# Altium project ToF Sensor.PrjPcb
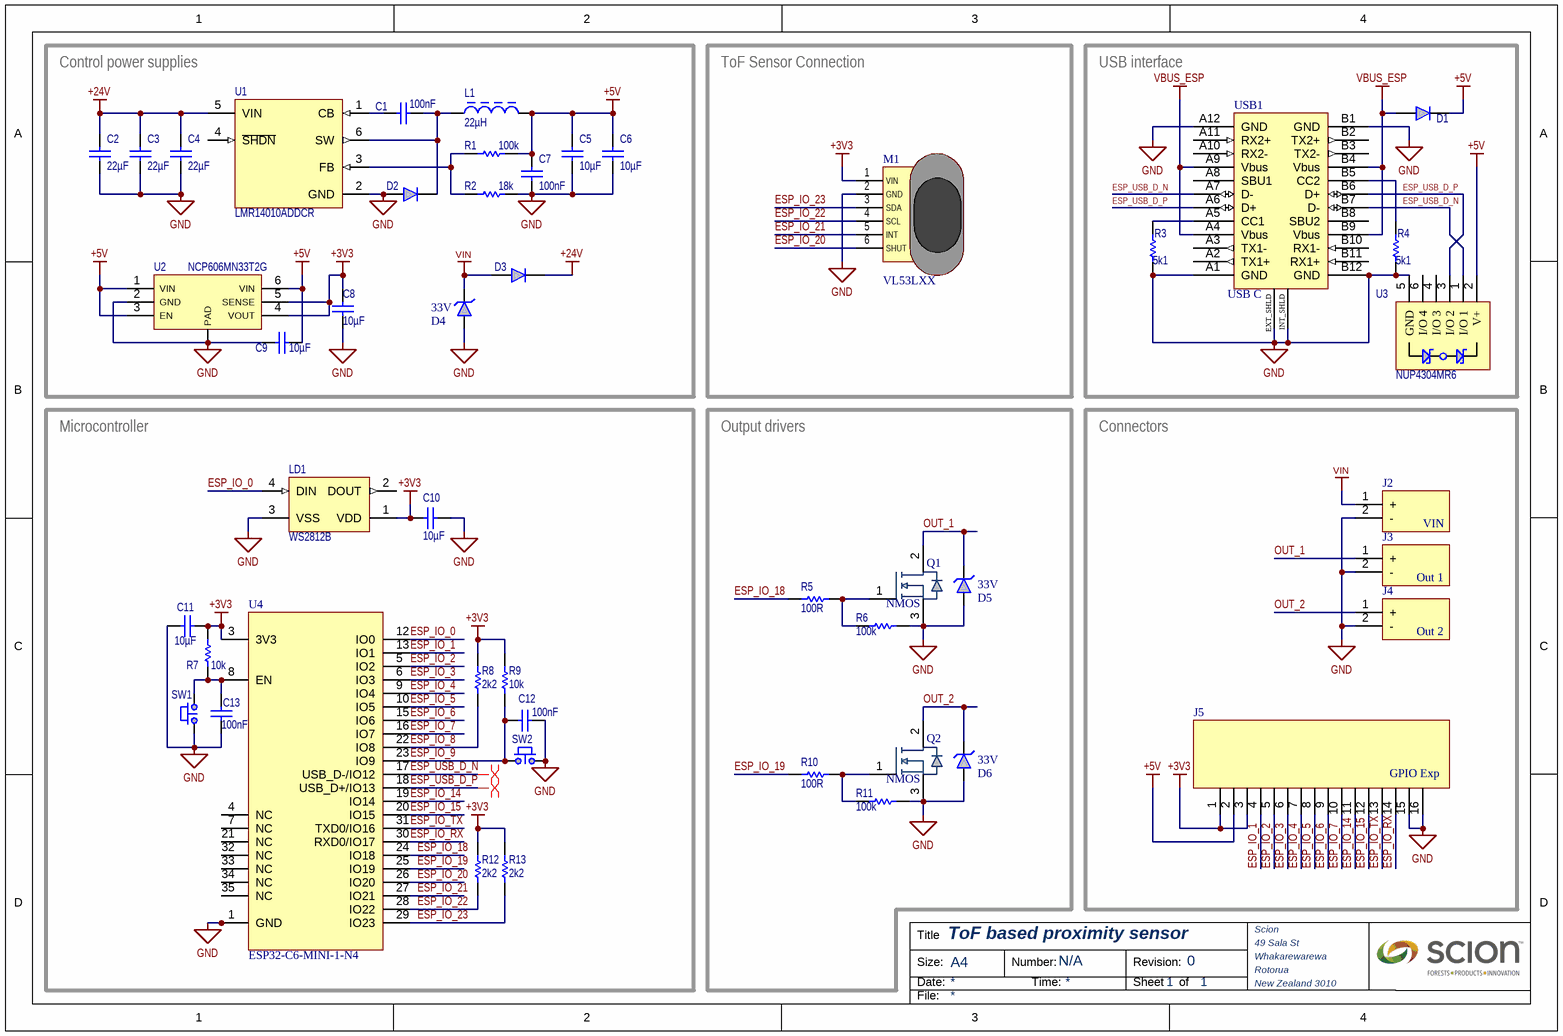
[diagram p0: ToF Sensor.SchDoc]
1 sheet, 48 parts. Net scope: global (net labels, ports and power ports of the same name join across sheets).
Board file: ToF Sensor.PcbDoc

## Sheet ToF Sensor.SchDoc: ToF based proximity sensor
size A4; Author: Peake J; CompanyName: Scion Research; DrawnBy: Peake J; Engineer: Peake J; Organization: Scion; Address1: 49 Sala St; Address2: Whakarewarewa; Address3: Rotorua; Address4: New Zealand 3010; DocumentNumber: N/A; Revision: 0; SheetNumber: 1; SheetTotal: 1

### Parts
C1  value 100nF  [0603_CAP]  (hidden comment: Capacitor)
C2  value 22µF  [1206_CAP]  (hidden comment: Capacitor)
C3  value 22µF  [1206_CAP]  (hidden comment: Capacitor)
C4  value 22µF  [1206_CAP]  (hidden comment: Capacitor)
C5  value 10µF  [0603_CAP]  (hidden comment: Capacitor)
C6  value 10µF  [0603_CAP]  (hidden comment: Capacitor)
C7  value 100nF  [0603_CAP]  (hidden comment: Capacitor)
C8  value 10µF  [0603_CAP]  (hidden comment: Capacitor)
C9  value 10µF  [0603_CAP]  (hidden comment: Capacitor)
C10  value 10µF  [0603_CAP]  (hidden comment: Capacitor)
C11  value 10µF  [0603_CAP]  (hidden comment: Capacitor)
C12  value 100nF  [0603_CAP]  (hidden comment: Capacitor)
C13  value 100nF  [0603_CAP]  (hidden comment: Capacitor)
D1  Diode  [SOD-123]  (value not drawn)
D2  Diode  [SOD-123]  (value not drawn)
D3  Diode  [SOD-123]  (value not drawn)
D4  Breakdown Voltage: 33V  [SMBJ]  (hidden comment: Transil)
D5  Breakdown Voltage: 33V  [SMBJ]  (hidden comment: Transil)
D6  Breakdown Voltage: 33V  [SMBJ]  (hidden comment: Transil)
J2  VIN  [2P 3.5mm Phoenix screw terminal 1988972]
J3  Out 1  [2P 3.5mm Phoenix screw terminal 1988972]
J4  Out 2  [2P 3.5mm Phoenix screw terminal 1988972]
J5  GPIO Exp  [DIP16]
L1  value 22µH  [BOUR-SRN8040_V]  (hidden comment: Inductor)
LD1  WS2812B  [WS2812B-2020]
M1  VL53LXX  [VL53LXX-Footprint-1]
Q1  NMOS  [SOT-23]
Q2  NMOS  [SOT-23]
R1  value 100k  [0603_RES]  (hidden comment: Resistor)
R2  value 18k  [0603_RES]  (hidden comment: Resistor)
R3  value 5k1  [0603_RES]  (hidden comment: Resistor)
R4  value 5k1  [0603_RES]  (hidden comment: Resistor)
R5  value 100R  [0603_RES]  (hidden comment: Resistor)
R6  value 100k  [0603_RES]  (hidden comment: Resistor)
R7  value 10k  [0603_RES]  (hidden comment: Resistor)
R8  value 2k2  [0603_RES]  (hidden comment: Resistor)
R9  value 10k  [0603_RES]  (hidden comment: Resistor)
R10  value 100R  [0603_RES]  (hidden comment: Resistor)
R11  value 100k  [0603_RES]  (hidden comment: Resistor)
R12  value 2k2  [0603_RES]  (hidden comment: Resistor)
R13  value 2k2  [0603_RES]  (hidden comment: Resistor)
SW1  EVP-AAN02Q  [FP-EVP-AAN02Q-MFG]  (value not drawn)
SW2  EVP-AAN02Q  [FP-EVP-AAN02Q-MFG]  (value not drawn)
U1  LMR14010ADDCR  [FP-DDC0006A-IPC_A]
U2  NCP606MN33T2G  [QFN95P330X295X100_HS-7N]
U3  NUP4304MR6  [TSOP-6]
U4  ESP32-C6-MINI-1-N4  [ESP32-C6-MINI-1-N4-Footprint-1]
USB1  USB C  [GT-USB-7010ASV]

### Blocks framed on the sheet
Control power supplies: C1-C9 D2-D4 L1 R1 R2 U1 U2
ToF Sensor Connection: M1
USB interface: D1 R3 R4 U3 USB1
Microcontroller: C10-C13 LD1 R7-R9 R12 R13 SW1 SW2 U4
Output drivers: D5 D6 Q1 Q2 R5 R6 R10 R11
Connectors: J2-J5

### Nets
+3V3: C8.1 C10.1 C11.1 J5.1 J5.3 LD1.1(VDD) M1.1(VIN) R7.1 R8.1 R9.1 R12.1 R13.1 U2.4(VOUT) U2.5(SENSE) U4.3(3V3)
+5V: C5.1 C6.1 C7.1 C9.1 D1.1(K) J5.2 L1.2 R1.2 U2.1(VIN) U2.3(EN) U2.6(VIN) U3.2(V+)
+24V: C2.1 C3.1 C4.1 D3.1(K) U1.5(VIN)
GND: C2.2 C3.2 C4.2 C5.2 C6.2 C7.2 C8.2 C9.2 C10.2 C11.2 C12.2 C13.2 D2.2(A) D4.1(A) D5.1(A) D6.1(A) J2.2(-) J3.2(-) J4.2(-) J5.15 J5.16 LD1.3(VSS) M1.2(GND) Q1.3(S) Q2.3(S) R2.2 R3.2 R4.2 R6.2 R11.2 SW1.1 SW2.2 U1.2(GND) U2.2(GND) U2.PAD U3.5(GND) U4.1(GND) U4.2(GND) U4.11(GND) U4.14(GND) U4.36(GND) U4.37(GND) U4.38(GND) U4.39(GND) U4.40(GND) U4.41(GND) U4.42(GND) U4.43(GND) U4.44(GND) U4.45(GND) U4.46(GND) U4.47(GND) U4.48(GND) U4.49(GND) U4.50(GND) U4.51(GND) U4.52(GND) U4.53(GND) USB1.A1(GND) USB1.A12(GND) USB1.B1(GND) USB1.B12(GND) USB1.EXT_SHLD USB1.INT_SHLD
VBUS_ESP: D1.2(A) USB1.A4(Vbus) USB1.A9(Vbus) USB1.B4(Vbus) USB1.B9(Vbus)
VIN: D3.2(A) D4.2(K) J2.1(+)
ESP_IO_0: LD1.4(DIN) U4.12(IO0)
ESP_IO_1: J5.4 U4.13(IO1)
ESP_IO_2: J5.5 U4.5(IO2)
ESP_IO_3: J5.6 U4.6(IO3)
ESP_IO_4: J5.7 U4.9(IO4)
ESP_IO_5: J5.8 U4.10(IO5)
ESP_IO_6: J5.9 U4.15(IO6)
ESP_IO_7: J5.10 U4.16(IO7)
ESP_IO_8: R8.2 U4.22(IO8)
ESP_IO_9: C12.1 R9.2 SW2.1 U4.23(IO9)
ESP_IO_14: J5.11 U4.19(IO14)
ESP_IO_15: J5.12 U4.20(IO15)
ESP_IO_18: R5.1 U4.24(IO18)
ESP_IO_19: R10.1 U4.25(IO19)
ESP_IO_20: M1.6(SHUT) U4.26(IO20)
ESP_IO_21: M1.5(INT) U4.27(IO21)
ESP_IO_22: M1.4(SCL) R12.2 U4.28(IO22)
ESP_IO_23: M1.3(SDA) R13.2 U4.29(IO23)
ESP_IO_RX: J5.14 U4.30(RXD0/IO17)
ESP_IO_TX: J5.13 U4.31(TXD0/IO16)
ESP_USB_D_N: U3.1(I/O_1) U4.17(USB_D-/IO12) USB1.A7(D-) USB1.B7(D-)
ESP_USB_D_P: U3.3(I/O_2) U4.18(USB_D+/IO13) USB1.A6(D+) USB1.B6(D+)
OUT_1: D5.2(K) J3.1(+) Q1.2(D)
OUT_2: D6.2(K) J4.1(+) Q2.2(D)
NetC1_1: C1.1 D2.1(K) L1.1 U1.6(SW)
NetC1_2: C1.2 U1.1(CB)
NetC13_1: C13.1 R7.2 SW1.2 U4.8(EN)
NetQ1_1: Q1.1(G) R5.2 R6.1
NetQ2_1: Q2.1(G) R10.2 R11.1
NetR1_1: R1.1 R2.1 U1.3(FB)
NetR3_1: R3.1 USB1.A5(CC1)
NetR4_1: R4.1 USB1.B5(CC2)

Not connected (* = marked no-connect by the designer): LD1 2(DOUT); U1 4(~{SHDN}); U3 4(I/O_3) 6(I/O_4); U4 4(NC) 7(NC) 21(NC) 32(NC) 33(NC) 34(NC) 35(NC); USB1 A2(TX1+) A3(TX1-) A8(SBU1) A10(RX2-) A11(RX2+) B2(TX2+) B3(TX2-) B8(SBU2) B10(RX1-) B11(RX1+)

### Layout directives
differential pair: ESP_USB_D_N, ESP_USB_D_P

### Notes on the sheet
- Title
- Size:
- Date:
- A4
- Number:
- Time:
- Revision:
- Sheet
- of
- File:

### Library data of the parts
C1-C13 = CMP-001-00172-2: SMD Capacitor; Pins: 2; Source: Discrete.SchLib; Design Item ID: Capacitor; Component Type: Standard
D1-D3 = CMP-004-00083-4: SMD Diode; Design Item ID: Diode; Pins: 2; Source: Discrete.SchLib; Component Type: Standard; Pin Count: 2
D4-D6 = CMP-079-000108-2: Transient Voltage Suppressor; Component Type: Standard; Rated Voltage: *; Pin Count: 2; Source: Discrete.SchLib; Design Item ID: Transil; MFN: *; Clamping Voltage: *
J2-J4 = CMP-002-00173-4: 2 Pin Connector; Pin Count: 2; Source: Connectors.SchLib; Pins: 2; Component Type: Standard; Design Item ID: 2_Pin; MFN: *
J5 = CMP-002-00172-3: 16 Pin Connector; Component Type: Standard; Pin Count: 16; Pins: 16; Design Item ID: 16_Pin; Source: Connectors.SchLib
L1 = CMP-006-00052-2: Power Inductor; DCR: 100mR; Current Rating: 2.2A; Pins: 2; Component Type: Standard; Design Item ID: Inductor; Source: Discrete.SchLib; Pin Count: 2; MFN: *
LD1 = CMP-079-000113-2: Intelligent Control LED Integrated Light Source, 3.5 to 5.3 V, -25 to 80 degC, 4-Pin SMD, RoHS, Bulk; Manufacturer: Adafruit Industries; Mounting Technology: SM; RoHS Compliant: False; Package Reference: WS2812B; Case/Package: WS2812B; Component Type: Standard; Manufacturer URL: https://www.adafruit.com/; Package Description: 4-Pin Surface Mount Device, Body 5 x 5 mm, Pitch 3.3 mm; Source: All Components - 30.06.23 - 18.27.SchLib; Datasheet Version: May-13; Datasheet URL: https://cdn-shop.adafruit.com/datasheets/WS2812B.pdf; Pin Count: 4; Design Item ID: CMP-007-00035-3
M1 = CMP-00026-00003-1: ST ToF sensor
Q1 Q2 = CMP-079-000093-2: N Channel MOSFET; Design Item ID: NMOS; Source: N-MOS.SchLib; MFN: *; Pin Count: 3; Component Type: Standard
R1 R2 R5-R13 = CMP-009-00356-1: SMD Resistor; Pins: 2; Source: Discrete.SchLib; Component Type: Standard; Design Item ID: Resistor
R3 R4 = CMP-009-00356-1: SMD Resistor; Value: 5k1; Pins: 2; Source: Discrete.SchLib; Component Type: Standard; Design Item ID: Resistor
SW1 SW2 = CMP-011-00000-2: Switch Tactile N.O. SPST Rectangular Button J-Bend 0.02A 15VDC 100000Cycles 5N SMD T/R
U1 = CMP-079-000005-5: 7-40VDC-DC buck converter; Number of Outputs: 1; Max Output Voltage: 40V; Output Current: 1A; Min Input Voltage: 4V; Output Type: Adjustable; Synchronous Rectifier: No; Min Output Voltage: 765mV; Output Configuration: Positive; Switching Frequency: 850kHz; Max Operating Temperature: 125°C; Case/Package: SOT-23-6; Features: UVLO; Pin Count: 6; Packaging: Cut Tape; Mount: Surface Mount; Component Type: Standard; Min Operating Temperature: -40°C; Max Input Voltage: 40V; Source: All Components - 30.06.23 - 18.27.SchLib; Design Item ID: CMP-00007-1
U2 = CMP-019-00001-1: Fixed Positive LDO Regulator, 3.3V, 0.22V Dropout, CMOS; Max Supply Voltage: 6V; RoHS Compliant: Yes; Case/Package: HVSON; Pins: 6
U3 = CMP-079-000096-2: ESD Protection Doide Array; Design Item ID: NUP4304MR6; Pin Count: 6; Component Type: Standard; Source: ON Semi.SchLib
U4 = CMP-00025-00001-2
USB1 = CMP-079-000004-4: Vertical or RA Type C Usb Connector Rohs Compliant: Yes; Pin Count: 26; Design Item ID: CMP-00005-5; Source: All Components - 30.06.23 - 18.27.SchLib; Component Type: Standard